# EAGLE design driverV3 (EAGLE 8.6.0)
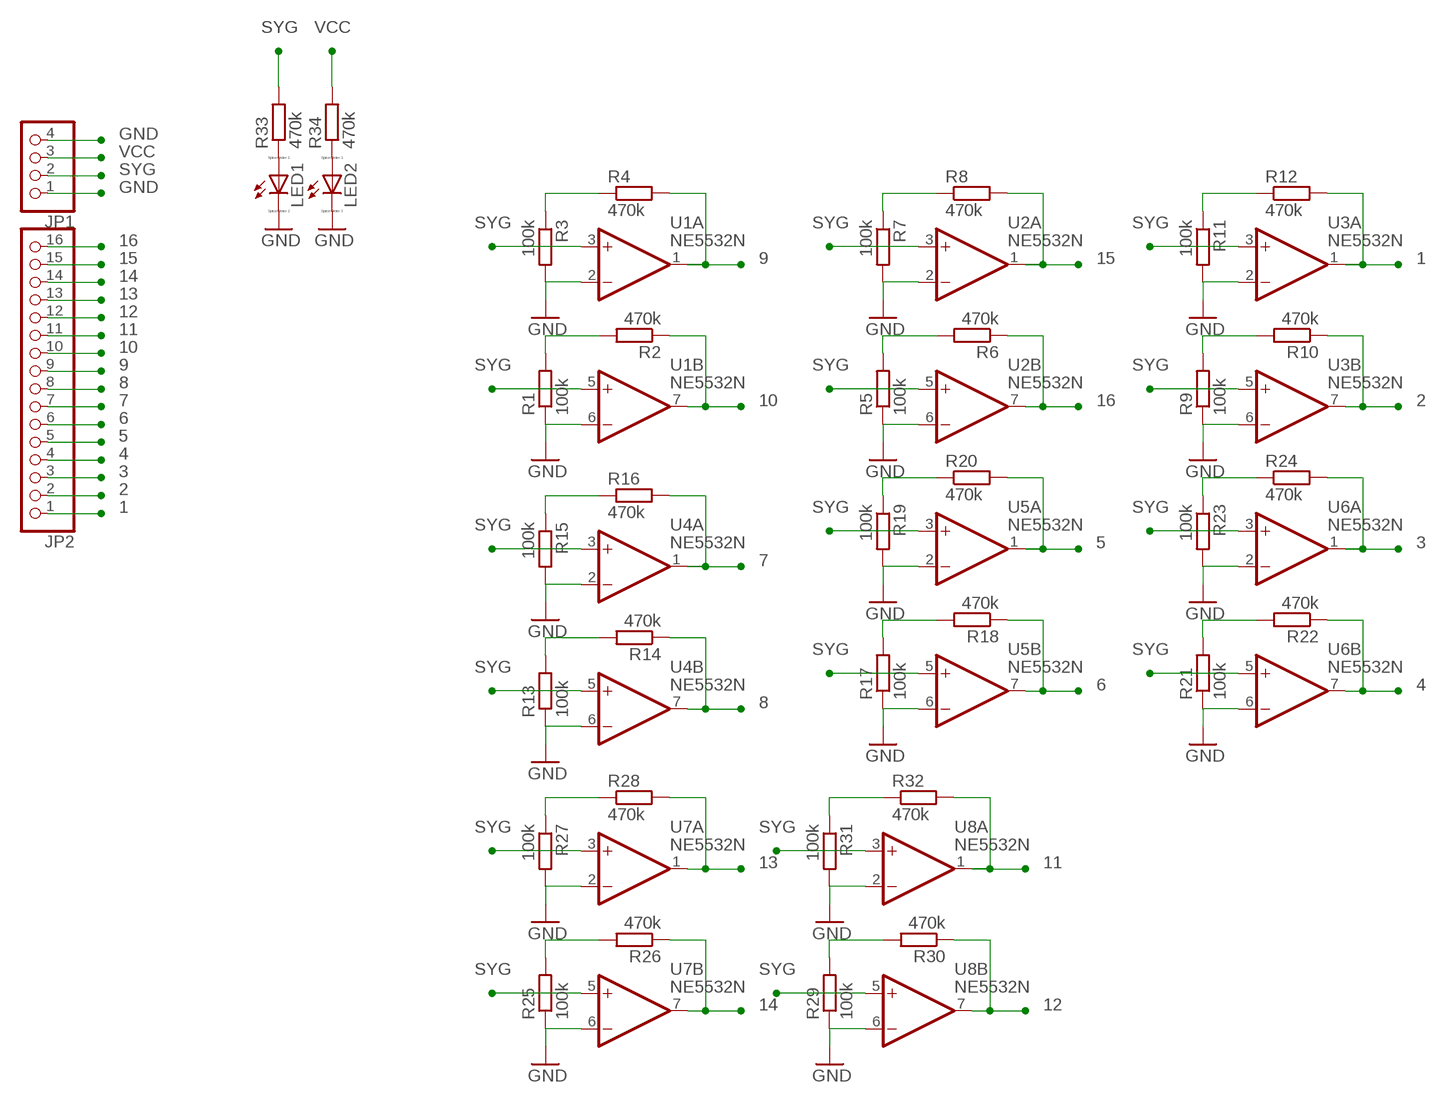
[diagram p0: schematic, sheet 1]

## Parts
JP1  PINHD-1X4  [1X04]
JP2  PINHD-1X16  [1X16]
LED1  LED_ELD260  [LED_LD260]
LED2  LED_ELD260  [LED_LD260]
R1  100k  R-EU_0204/7  [0204/7]
R2  470k  R-EU_0204/7  [0204/7]
R3  100k  R-EU_0204/7  [0204/7]
R4  470k  R-EU_0204/7  [0204/7]
R5  100k  R-EU_0204/7  [0204/7]
R6  470k  R-EU_0204/7  [0204/7]
R7  100k  R-EU_0204/7  [0204/7]
R8  470k  R-EU_0204/7  [0204/7]
R9  100k  R-EU_0204/7  [0204/7]
R10  470k  R-EU_0204/7  [0204/7]
R11  100k  R-EU_0204/7  [0204/7]
R12  470k  R-EU_0204/7  [0204/7]
R13  100k  R-EU_0204/7  [0204/7]
R14  470k  R-EU_0204/7  [0204/7]
R15  100k  R-EU_0204/7  [0204/7]
R16  470k  R-EU_0204/7  [0204/7]
R17  100k  R-EU_0204/7  [0204/7]
R18  470k  R-EU_0204/7  [0204/7]
R19  100k  R-EU_0204/7  [0204/7]
R20  470k  R-EU_0204/7  [0204/7]
R21  100k  R-EU_0204/7  [0204/7]
R22  470k  R-EU_0204/7  [0204/7]
R23  100k  R-EU_0204/7  [0204/7]
R24  470k  R-EU_0204/7  [0204/7]
R25  100k  R-EU_0204/7  [0204/7]
R26  470k  R-EU_0204/7  [0204/7]
R27  100k  R-EU_0204/7  [0204/7]
R28  470k  R-EU_0204/7  [0204/7]
R29  100k  R-EU_0204/7  [0204/7]
R30  470k  R-EU_0204/7  [0204/7]
R31  100k  R-EU_0204/7  [0204/7]
R32  470k  R-EU_0204/7  [0204/7]
R33  470k  R-EU_0204/7  [0204/7]
R34  470k  R-EU_0204/7  [0204/7]
U1  NE5532N  [DIL08]
U2  NE5532N  [DIL08]
U3  NE5532N  [DIL08]
U4  NE5532N  [DIL08]
U5  NE5532N  [DIL08]
U6  NE5532N  [DIL08]
U7  NE5532N  [DIL08]
U8  NE5532N  [DIL08]

## Nets
1: JP2.1 R12.2 U3.1(A:OUT)
2: JP2.2 R10.1 U3.7(B:OUT)
3: JP2.3 R24.2 U6.1(A:OUT)
4: JP2.4 R22.1 U6.7(B:OUT)
5: JP2.5 R20.2 U5.1(A:OUT)
6: JP2.6 R18.1 U5.7(B:OUT)
7: JP2.7 R16.2 U4.1(A:OUT)
8: JP2.8 R14.1 U4.7(B:OUT)
9: JP2.9 R4.2 U1.1(A:OUT)
10: JP2.10 R2.1 U1.7(B:OUT)
11: JP2.11 R32.2 U8.1(A:OUT)
12: JP2.12 R30.1 U8.7(B:OUT)
13: JP2.13 R28.2 U7.1(A:OUT)
14: JP2.14 R26.1 U7.7(B:OUT)
15: JP2.15 R8.2 U2.1(A:OUT)
16: JP2.16 R6.1 U2.7(B:OUT)
GND: JP1.1 JP1.4 LED1.K(C) LED2.K(C) R1.1 R3.2 R5.1 R7.2 R9.1 R11.2 R13.1 R15.2 R17.1 R19.2 R21.1 R23.2 R25.1 R27.2 R29.1 R31.2 U1.2(A:-IN) U1.6(B:-IN) U2.2(A:-IN) U2.6(B:-IN) U3.2(A:-IN) U3.6(B:-IN) U4.2(A:-IN) U4.6(B:-IN) U5.2(A:-IN) U5.6(B:-IN) U6.2(A:-IN) U6.6(B:-IN) U7.2(A:-IN) U7.6(B:-IN) U8.2(A:-IN) U8.6(B:-IN)
N$1: R5.2 R6.2
N$2: R1.2 R2.2
N$3: R7.1 R8.1
N$4: R9.2 R10.2
N$5: R3.1 R4.1
N$6: R11.1 R12.1
N$7: R13.2 R14.2
N$8: R15.1 R16.1
N$9: R17.2 R18.2
N$10: R19.1 R20.1
N$11: R21.2 R22.2
N$12: R23.1 R24.1
N$13: R25.2 R26.2
N$14: R27.1 R28.1
N$15: R29.2 R30.2
N$16: R31.1 R32.1
N$17: LED1.A R33.1
N$18: LED2.A R34.1
SYG: JP1.2 R33.2 U1.3(A:+IN) U1.5(B:+IN) U2.3(A:+IN) U2.5(B:+IN) U3.3(A:+IN) U3.5(B:+IN) U4.3(A:+IN) U4.5(B:+IN) U5.3(A:+IN) U5.5(B:+IN) U6.3(A:+IN) U6.5(B:+IN) U7.3(A:+IN) U7.5(B:+IN) U8.3(A:+IN) U8.5(B:+IN)
VCC: JP1.3 R34.2

## Power pins joined to a net without a drawn wire
GND: U1.4(P:V-) U2.4(P:V-) U3.4(P:V-) U4.4(P:V-) U5.4(P:V-) U6.4(P:V-) U7.4(P:V-) U8.4(P:V-)
VCC: U1.8(P:V+) U2.8(P:V+) U3.8(P:V+) U4.8(P:V+) U5.8(P:V+) U6.8(P:V+) U7.8(P:V+) U8.8(P:V+)

## Library data of the parts
JP1 = pinhead:PINHD-1X4: PIN HEADER
JP2 = pinhead:PINHD-1X16: PIN HEADER
LED1 LED2 = eagle-ltspice:LED_E: LED Source: http://www.osram.convergy.de Source: www.luxeon.com Source: www.kingbright.com; SPICEMODEL: NONE; SPICEPREFIX: D; SPICETYPE: diode
R1-R34 = resistor:R-EU_: RESISTOR, European symbol
U1-U8 = op-amp:NE5532: OP-AMP

## Board
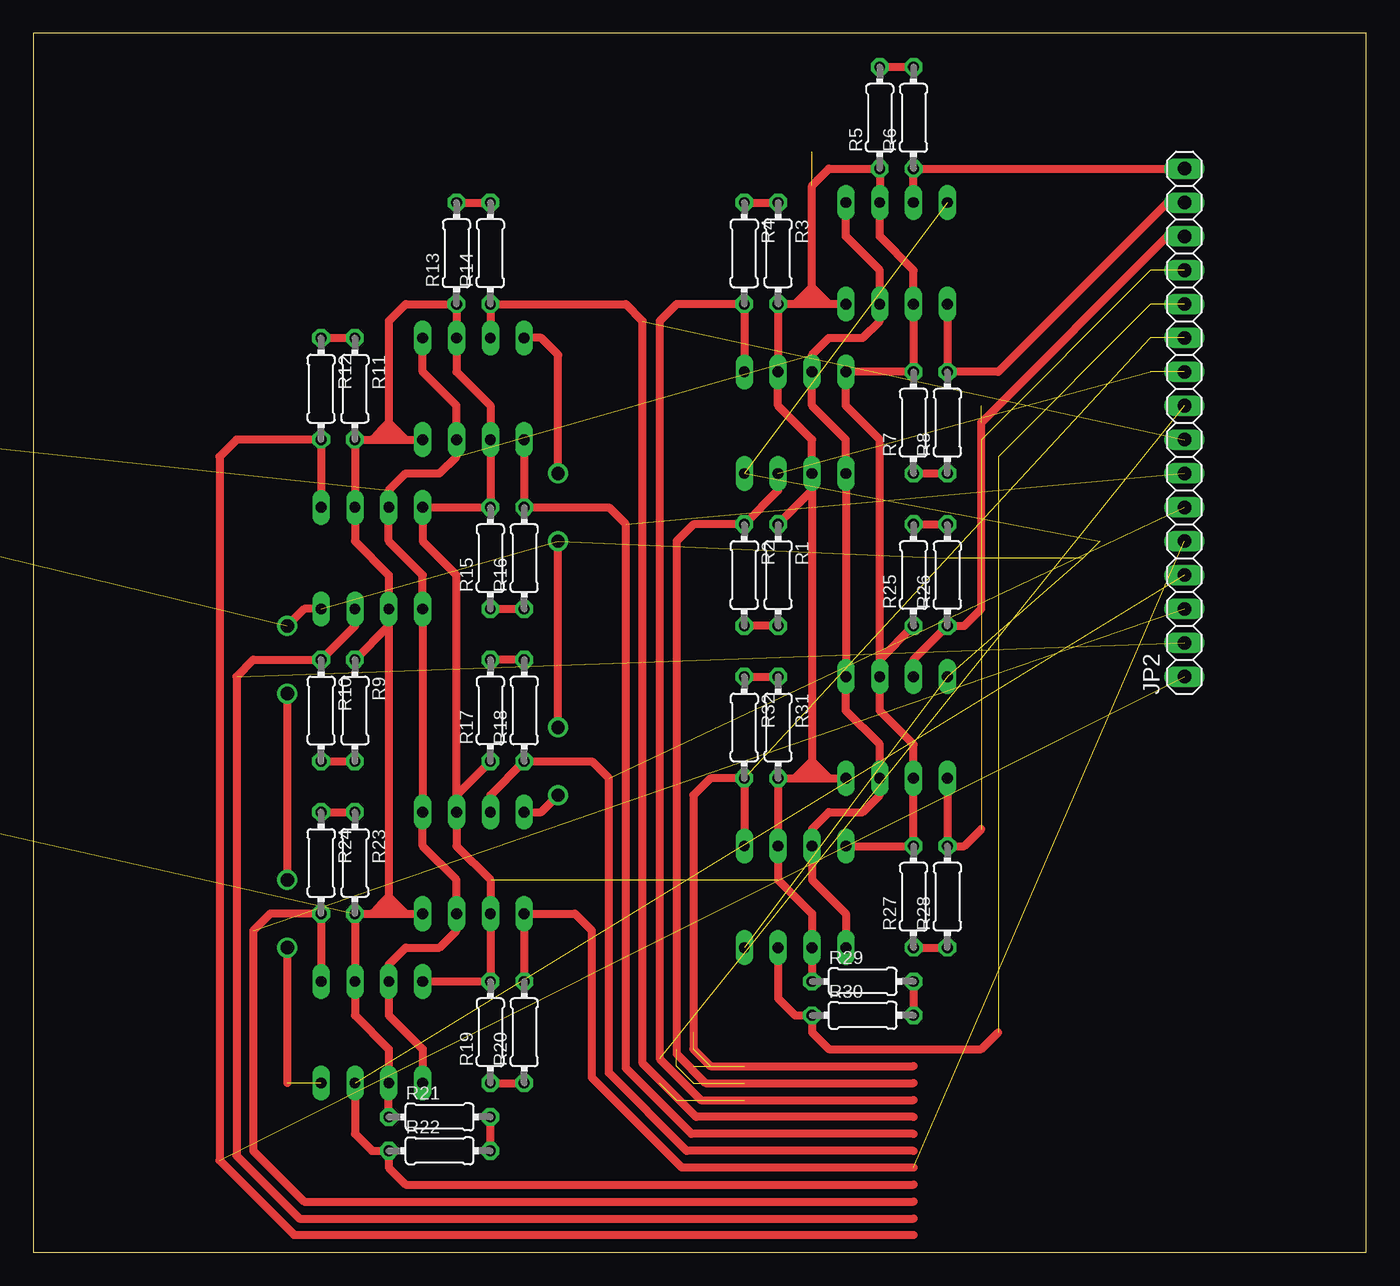
[diagram p1: board, top side]
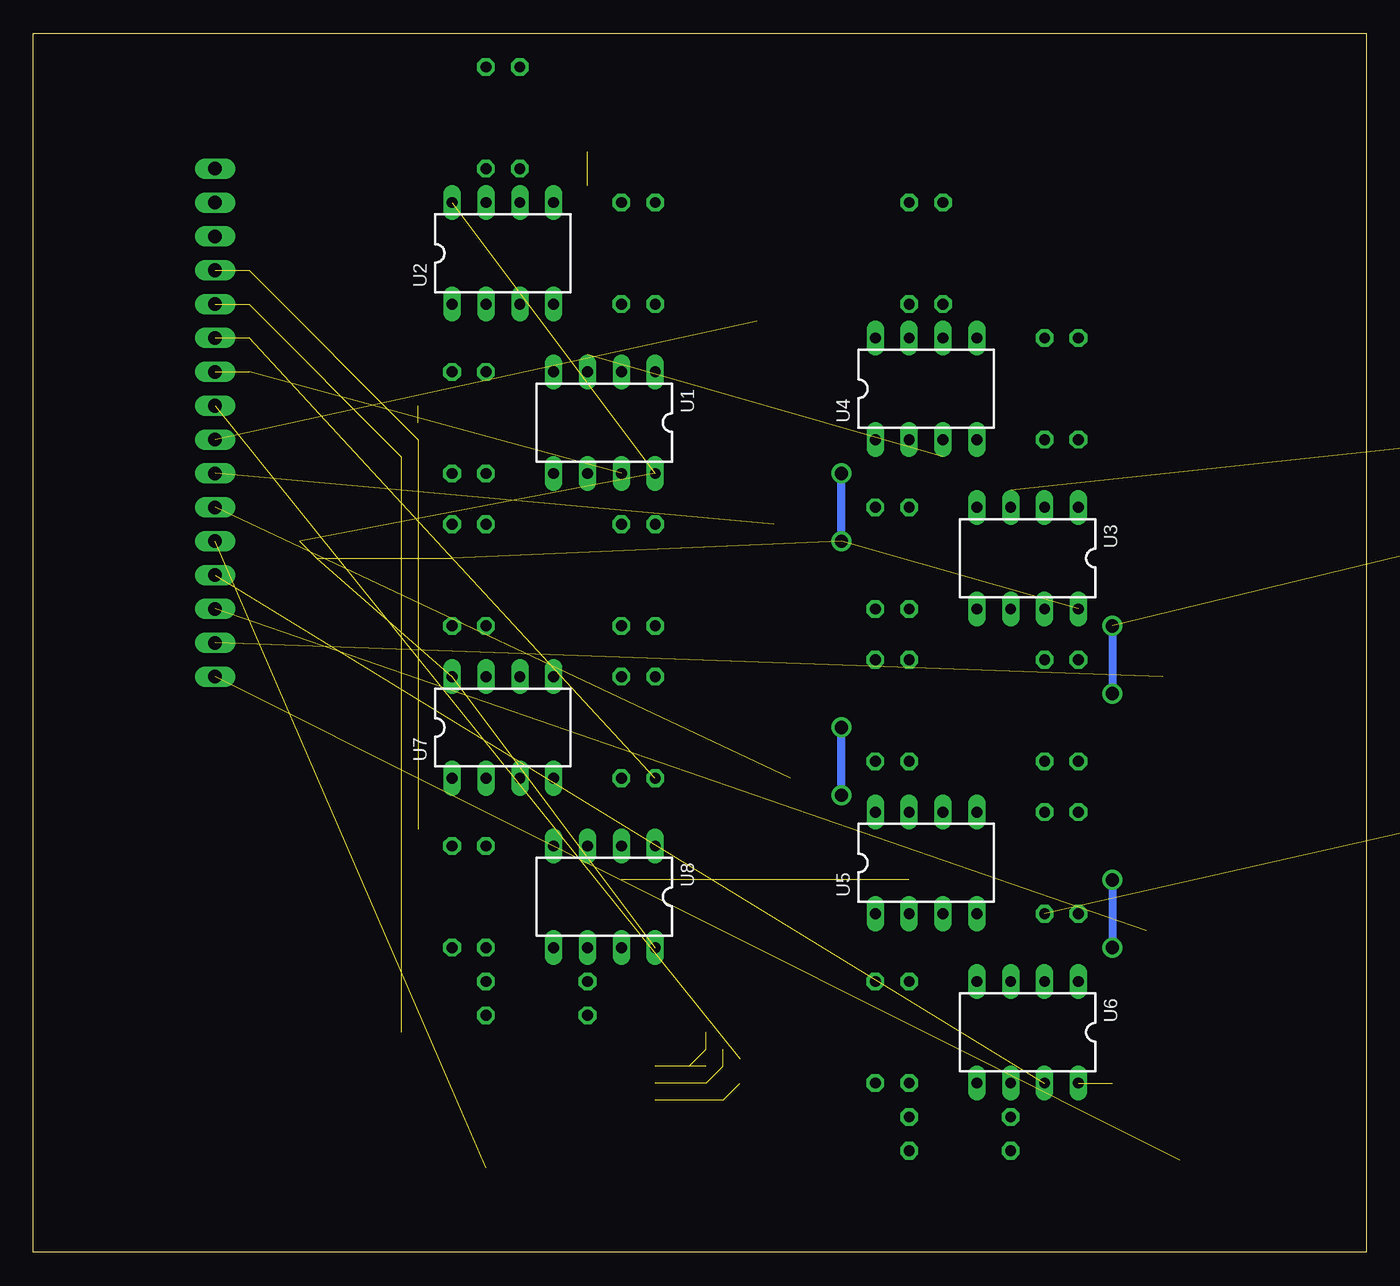
[diagram p2: board, bottom side, seen from below]

Size 100 x 91.43 mm. Coordinates in mm from the lower left corner, seen from the top.
Outline: 0,0 100,0 100,91.43 0,91.43 0,0
Copper layers (1*16): Top 0.035mm / dielectric 1.5mm / Bottom 0.035mm
Design rules "default *": minimum track width 6mil, minimum drill 0.35mm, track to track 0.55mm, track to pad 0.55mm, pad to pad 0.55mm, via to via 0.55mm, smd to smd 6mil, copper to edge 40mil, drill to drill 6mil, minimum pad ring 10mil, minimum via ring 8mil, stop-mask expansion 4mil, vias tented up to drill 0mil, thermal gap 10mil

### Footprints (pad centres in the part's own frame; a part is rotated, then mirrored left to right if it is on the bottom)
1X04 = drill 1.016 long: 1 -3.81,0; 2 -1.27,0; 3 1.27,0; 4 3.81,0
1X16 = drill 1.016 long: 1 -19.05,0; 2 -16.51,0; 3 -13.97,0; 4 -11.43,0; 5 -8.89,0; 6 -6.35,0; 7 -3.81,0; 8 -1.27,0; 9 1.27,0; 10 3.81,0; 11 6.35,0; 12 8.89,0; 13 11.43,0; 14 13.97,0; 15 16.51,0; 16 19.05,0
LED_LD260 = drill 0.813 octagon: A -1.27,0; K 1.27,0
0204/7 = drill 0.813 octagon: 1 -3.81,0; 2 3.81,0
DIL08 = drill 0.813 long: 1 -3.81,-3.81; 2 -1.27,-3.81; 3 1.27,-3.81; 4 3.81,-3.81; 5 3.81,3.81; 6 1.27,3.81; 7 -1.27,3.81; 8 -3.81,3.81

### Placement (x,y rotation side)
JP1  -60.96,29.21 0 top  (outside the outline)
JP2  86.36,62.23 90 top
LED1  -16.51,34.29 0 top  (outside the outline)
LED2  -21.59,34.29 0 top  (outside the outline)
R1  55.88,50.8 270 top
R2  53.34,50.8 270 top
R3  55.88,74.93 270 top
R4  53.34,74.93 270 top
R5  63.5,85.09 90 top
R6  66.04,85.09 90 top
R7  66.04,62.23 90 top
R8  68.58,62.23 90 top
R9  24.13,40.64 270 top
R10  21.59,40.64 270 top
R11  24.13,64.77 270 top
R12  21.59,64.77 270 top
R13  31.75,74.93 90 top
R14  34.29,74.93 90 top
R15  34.29,52.07 90 top
R16  36.83,52.07 90 top
R17  34.29,40.64 90 top
R18  36.83,40.64 90 top
R19  34.29,16.51 90 top
R20  36.83,16.51 90 top
R21  30.48,10.16 0 top
R22  30.48,7.62 0 top
R23  24.13,29.21 270 top
R24  21.59,29.21 270 top
R25  66.04,50.8 90 top
R26  68.58,50.8 90 top
R27  66.04,26.67 90 top
R28  68.58,26.67 90 top
R29  62.23,20.32 0 top
R30  62.23,17.78 0 top
R31  55.88,39.37 270 top
R32  53.34,39.37 270 top
R33  -48.26,64.77 0 top  (outside the outline)
R34  -58.42,64.77 0 top  (outside the outline)
U1  57.15,62.23 180 bottom
U2  64.77,74.93 0 bottom
U3  25.4,52.07 180 bottom
U4  33.02,64.77 0 bottom
U5  33.02,29.21 0 bottom
U6  25.4,16.51 180 bottom
U7  64.77,39.37 0 bottom
U8  57.15,26.67 180 bottom

### Tracks (layer width: path | path; a pad name or v marks a point on that pad's centre or on a via)
1  (1 unrouted)
  Top 0.6: U3.1 R12.2 15.24,60.96 13.97,59.69 13.97,6.91 19.56,1.32 66.04,1.32
2  (1 unrouted)
  Top 0.6: U3.7 24.13,46.99 R10.1 16.51,44.45 15.24,43.18 15.24,7.26 19.96,2.54 66.04,2.54
3  (1 unrouted)
  Top 0.6: U6.1 R24.2 17.78,25.4 16.51,24.13 16.51,7.62 20.32,3.81 66.04,3.81
4  (1 unrouted)
  Top 0.6: U6.7 24.13,8.89 25.4,7.62 R22.1 26.67,6.35 27.94,5.08 66.04,5.08
5  (1 unrouted)
  Top 0.6: R20.2 U5.1 40.64,25.4 41.91,24.13 41.91,13.1 48.66,6.35 66.04,6.35
6  (1 unrouted)
  Top 0.6: U5.7 34.29,34.29 R18.1 41.91,36.83 43.18,35.56 43.18,13.46 49.02,7.62 66.04,7.62
7  (1 unrouted)
  Top 0.6: U4.1 R16.2 43.18,55.88 44.45,54.61 44.45,13.81 49.38,8.89 66.04,8.89
8  (1 unrouted)
  Top 0.6: U4.7 R14.1 44.45,71.12 45.72,69.85 45.72,14.17 49.73,10.16 66.04,10.16
9  (1 unrouted)
  Top 0.6: U1.1 R4.2 48.26,71.12 46.99,69.85 46.99,14.53 50.09,11.43 66.04,11.43
10  (2 unrouted)
  Top 0.6: U1.7 55.88,57.15 R2.1 49.53,54.61 48.26,53.34 48.26,14.88 50.44,12.7 66.04,12.7
11  (2 unrouted)
  Top 0.6: U8.1 R32.2 50.8,35.56 49.53,34.29 49.53,15.24 50.8,13.97 66.04,13.97
12  (3 unrouted)
  Top 0.6: U8.7 55.88,19.05 57.15,17.78 R30.1 58.42,16.51 59.69,15.24 71.12,15.24 72.39,16.51
13  (3 unrouted)
  Top 0.6: U7.1 R28.2 69.85,30.48 71.12,31.75
14  (1 unrouted)
  Top 0.6: U7.7 66.04,44.45 R26.1 69.85,46.99 71.12,48.26 71.12,62.23 85.09,76.2 JP2.14
15
  Top 0.6: U2.1 R8.2 72.39,66.04 85.09,78.74 JP2.15
16
  Top 0.6: U2.7 R6.1 JP2.16
GND  (6 unrouted)
  Top 0.6: 25.4,60.96 R11.2 U3.2 24.13,53.34 26.67,50.8 U3.6 26.67,46.99 | 25.4,60.96 26.67,60.96 | 26.67,60.96 27.94,60.96 | 27.94,60.96 U4.4 | R21.1 U6.6 26.67,15.24 24.13,17.78 U6.2 R23.2 25.4,25.4 | U5.6 31.75,30.48 34.29,27.94 U5.2 R19.2 U6.4 | 26.67,46.99 26.67,26.67 | 26.67,25.4 27.94,25.4 | 27.94,25.4 U5.4 | 26.67,26.67 26.67,25.4 | 26.67,26.67 27.3,26.04 | 27.3,26.04 27.94,25.4 | 26.67,25.4 27.3,26.04 | R9.1 26.67,46.99 | U5.6 31.75,34.29 R17.1 | U5.6 31.75,50.8 29.21,53.34 U3.4 R15.2 U4.2 34.29,63.5 31.75,66.04 U4.6 R13.1 27.94,71.12 26.67,69.85 26.67,62.23 | 26.67,62.23 26.04,61.6 | 26.04,61.6 25.4,60.96 | 26.67,62.23 27.3,61.6 | 27.3,61.6 27.94,60.96 | 26.67,60.96 26.67,62.23 | 26.67,60.96 26.04,61.6 | 26.67,60.96 27.3,61.6 | 25.4,25.4 26.67,25.4 | 26.67,26.67 26.04,26.04 | 26.04,26.04 25.4,25.4 | 26.67,25.4 26.04,26.04 | R29.1 U8.6 58.42,25.4 55.88,27.94 U8.2 R31.2 57.15,35.56 | U8.4 R27.2 U7.2 66.04,38.1 63.5,40.64 U7.6 | 57.15,35.56 58.42,35.56 | 58.42,35.56 59.69,35.56 | 59.69,35.56 U7.4 | 58.42,36.83 57.78,36.2 | 57.78,36.2 57.15,35.56 | 58.42,36.83 59.05,36.2 | 59.05,36.2 59.69,35.56 | 58.42,36.83 58.42,35.56 | 58.42,35.56 59.05,36.2 | 58.42,35.56 57.78,36.2 | U7.6 63.5,44.45 R25.1 | 58.42,57.15 U1.6 58.42,60.96 55.88,63.5 U1.2 R3.2 57.15,71.12 | 58.42,57.15 58.42,36.83 | R1.1 58.42,57.15 | U7.6 63.5,60.96 60.96,63.5 U1.4 R7.2 U2.2 66.04,73.66 63.5,76.2 U2.6 R5.1 59.69,81.28 58.42,80.01 58.42,72.39 | U2.4 59.69,71.12 | 59.69,71.12 58.42,71.12 | 58.42,71.12 57.15,71.12 | 58.42,71.12 58.42,72.39 | 58.42,72.39 57.78,71.75 | 57.78,71.75 57.15,71.12 | 58.42,72.39 59.05,71.75 | 59.05,71.75 59.69,71.12 | 58.42,71.12 59.05,71.75 | 58.42,71.12 57.78,71.75
N$1
  Top 0.6: R6.2 R5.2
N$2
  Top 0.6: R1.2 R2.2
N$3
  Top 0.6: R7.1 R8.1
N$4
  Top 0.6: R10.2 R9.2
N$5
  Top 0.6: R4.1 R3.1
N$6
  Top 0.6: R12.1 R11.1
N$7
  Top 0.6: R13.2 R14.2
N$8
  Top 0.6: R15.1 R16.1
N$9
  Top 0.6: R18.2 R17.2
N$10
  Top 0.6: R19.1 R20.1
N$11
  Top 0.6: R22.2 R21.2
N$12
  Top 0.6: R24.1 R23.1
N$13
  Top 0.6: R25.2 R26.2
N$14
  Top 0.6: R27.1 R28.1
N$15
  Top 0.6: R29.2 R30.2
N$16
  Top 0.6: R32.1 R31.1
N$17  (1 unrouted)
N$18  (1 unrouted)
N$19  (2 unrouted)
N$20  (3 unrouted)
N$21  (4 unrouted)
SYG  (3 unrouted)
  Top 0.6: U4.5 29.21,66.04 31.75,63.5 U4.3 31.75,59.69 30.48,58.42 27.94,58.42 26.67,57.15 U3.3 26.67,53.34 29.21,50.8 U3.5 U5.5 29.21,30.48 31.75,27.94 U5.3 31.75,24.13 30.48,22.86 27.94,22.86 26.67,21.59 U6.3 26.67,17.78 29.21,15.24 U6.5 | U8.5 60.96,25.4 58.42,27.94 U8.3 58.42,31.75 59.69,33.02 62.23,33.02 63.5,34.29 U7.3 63.5,38.1 60.96,40.64 U7.5 U1.5 60.96,60.96 58.42,63.5 U1.3 58.42,67.31 59.69,68.58 62.23,68.58 63.5,69.85 U2.3 63.5,73.66 60.96,76.2 U2.5
VCC  (via drill 1 pad 1.5)  (11 unrouted)
  Top 0.6: v39.37,39.37 v39.37,53.34 | v39.37,58.42 39.37,67.31 38.1,68.58 U4.8 | U5.8 38.1,33.02 v39.37,34.29 | U3.8 20.32,48.26 v19.05,46.99 | v19.05,41.91 v19.05,27.94 | v19.05,22.86 19.05,12.7
  Bottom 0.6: v39.37,34.29 v39.37,39.37 | v39.37,53.34 v39.37,58.42 | v19.05,46.99 v19.05,41.91 | v19.05,27.94 v19.05,22.86